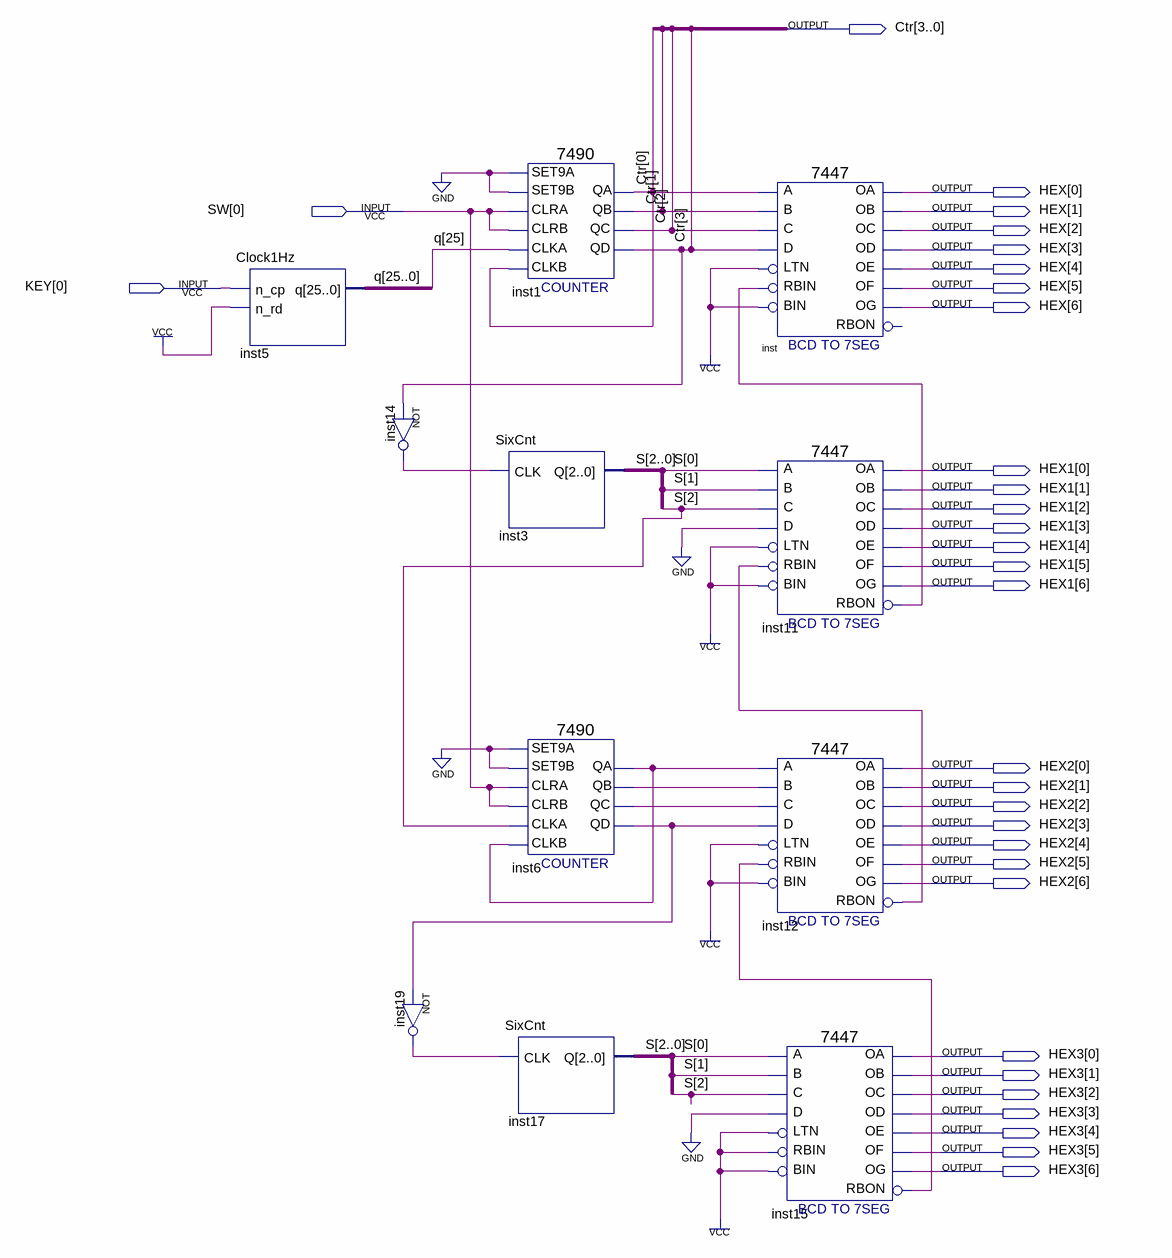
[diagram p0: schematic sheet]
// Quartus schematic 3digitsSeg.bdf as structural Verilog: 11 symbols, 31 pins
module \3digitsSeg  (
  input  [0:0] SW,
  input  [0:0] KEY,
  output [3:0] Ctr,
  output [6:0] HEX,
  output [6:0] HEX1,
  output [6:0] HEX2,
  output [6:0] HEX3
);

  wire inst6_qa, inst6_qb, inst6_qc, inst6_qd, inst11_rbon, inst12_rbon, inst14_out, inst15_rbon, inst19_out;
  wire [2:0] S;
  wire [25:0] q;

  Clock1Hz inst5 (.n_cp(KEY[0]), .n_rd(1'b1), .q(q));
  not inst14 (inst14_out, Ctr[3]);
  not inst19 (inst19_out, inst6_qd);
  SixCnt inst3 (.CLK(inst14_out), .Q(S));
  SixCnt inst17 (.CLK(inst19_out), .Q(S));
  \7490  inst1 (
    .SET9A(1'b0), .CLRA(SW[0]), .SET9B(1'b0), .CLKB(Ctr[0]), .CLKA(q[25]), .CLRB(SW[0]), .QD(Ctr[3]),
    .QA(Ctr[0]), .QB(Ctr[1]), .QC(Ctr[2]));
  \7490  inst6 (
    .SET9A(1'b0), .CLRA(SW[0]), .SET9B(1'b0), .CLKB(inst6_qa), .CLKA(S[2]), .CLRB(SW[0]), .QD(inst6_qd),
    .QA(inst6_qa), .QB(inst6_qb), .QC(inst6_qc));
  \7447  inst (
    .LTN(1'b1), .B(Ctr[1]), .C(Ctr[2]), .D(Ctr[3]), .RBIN(inst11_rbon), .BIN(1'b1), .A(Ctr[0]), .OB(HEX[1]),
    .OC(HEX[2]), .OE(HEX[4]), .OD(HEX[3]), .OF(HEX[5]), .OG(HEX[6]), .OA(HEX[0]));  // open: RBON
  \7447  inst11 (
    .LTN(1'b1), .B(S[1]), .C(S[2]), .D(1'b0), .RBIN(inst12_rbon), .BIN(1'b1), .A(S[0]), .OB(HEX1[1]),
    .OC(HEX1[2]), .OE(HEX1[4]), .OD(HEX1[3]), .OF(HEX1[5]), .OG(HEX1[6]), .OA(HEX1[0]), .RBON(inst11_rbon));
  \7447  inst12 (
    .LTN(1'b1), .B(inst6_qb), .C(inst6_qc), .D(inst6_qd), .RBIN(inst15_rbon), .BIN(1'b1), .A(inst6_qa),
    .OB(HEX2[1]), .OC(HEX2[2]), .OE(HEX2[4]), .OD(HEX2[3]), .OF(HEX2[5]), .OG(HEX2[6]), .OA(HEX2[0]),
    .RBON(inst12_rbon));
  \7447  inst15 (
    .LTN(1'b1), .B(S[1]), .C(S[2]), .D(1'b0), .RBIN(1'b1), .BIN(1'b1), .A(S[0]), .OB(HEX3[1]), .OC(HEX3[2]),
    .OE(HEX3[4]), .OD(HEX3[3]), .OF(HEX3[5]), .OG(HEX3[6]), .OA(HEX3[0]), .RBON(inst15_rbon));
endmodule
